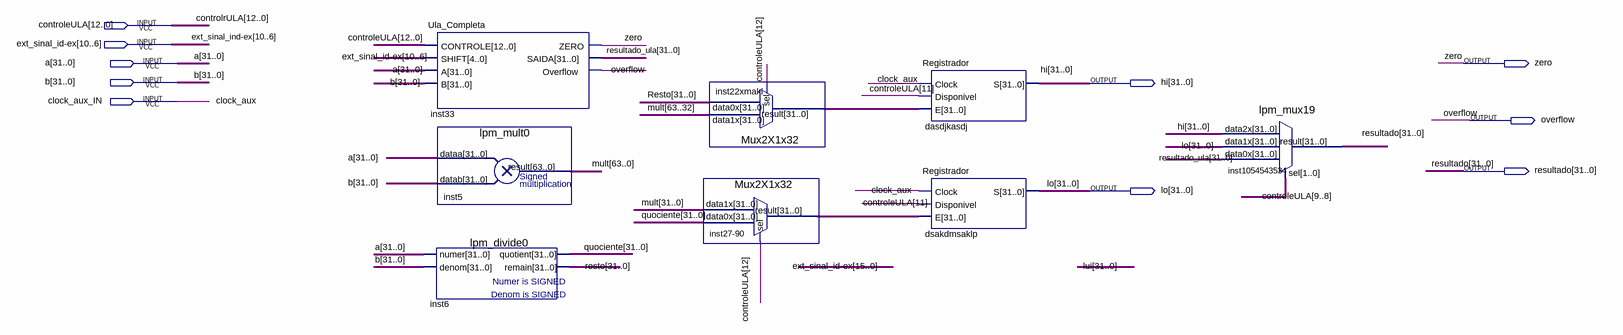
[diagram p0: schematic sheet]
// Quartus schematic ULATotal.bdf as structural Verilog: 8 symbols, 10 pins
module ULATotal (
  input  [12:0] controleULA,
  input  [10:6] \ext_sinal_id-ex ,
  input  [31:0] a,
  input  [31:0] b,
  input  clock_aux_IN,
  output zero,
  output [31:0] hi,
  output overflow,
  output [31:0] resultado,
  output [31:0] lo
);

  wire [31:0] inst22xmakl_result, inst27_90_result, quociente, Resto, resultado_ula;
  wire [63:0] mult;

  Ula_Completa inst33 (
    .CONTROLE(controleULA), .SHIFT(\ext_sinal_id-ex ), .A(a), .B(b), .ZERO(zero), .SAIDA(resultado_ula),
    .Overflow(overflow));
  lpm_mult0 inst5 (.dataa(a), .datab(b), .result(mult));
  lpm_divide0 inst6 (.numer(a), .denom(b), .quotient(quociente), .remain(Resto));
  Mux2X1x32 inst22xmakl (.data1x(mult[63:32]), .data0x(Resto), .sel(controleULA[12]), .result(inst22xmakl_result));
  Mux2X1x32 \inst27-90  (.data1x(mult[31:0]), .data0x(quociente), .sel(controleULA[12]), .result(inst27_90_result));
  Registrador dasdjkasdj (.Clock(clock_aux_IN), .Disponivel(controleULA[11]), .E(inst22xmakl_result), .S(hi));
  Registrador dsakdmsaklp (.Clock(clock_aux_IN), .Disponivel(controleULA[11]), .E(inst27_90_result), .S(lo));
  lpm_mux19 inst1054543534 (
    .data2x(hi), .data1x(lo), .data0x(resultado_ula), .sel(controleULA[9:8]), .result(resultado));

  // Other names for the same wires on the sheet: clock_aux = clock_aux_IN; controlrULA[12:0] = controleULA;
  //   ext_sinal_ind-ex[10:6] = \ext_sinal_id-ex 
endmodule
